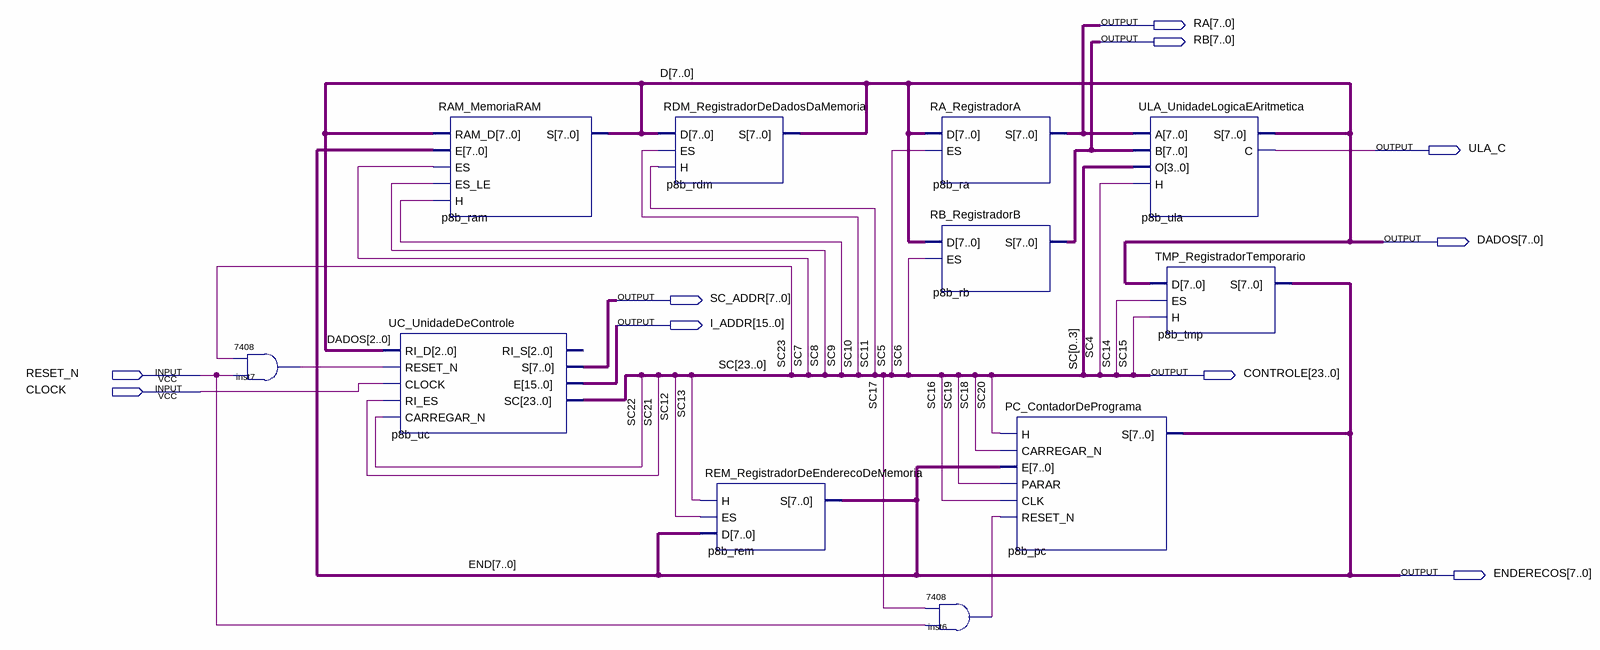
[diagram p0: schematic sheet]
// Quartus schematic Processador.bdf as structural Verilog: 11 symbols, 10 pins
module Processador (
  input  RESET_N,
  input  CLOCK,
  output [7:0] RA,
  output [7:0] RB,
  output ULA_C,
  output [7:0] DADOS,
  output [7:0] SC_ADDR,
  output [15:0] I_ADDR,
  output [23:0] CONTROLE,
  output [7:0] ENDERECOS
);

  wire inst6_1, inst7_1;

  \7408  inst7 (.\3 (RESET_N), .\2 (CONTROLE[23]), .\1 (inst7_1));
  UC_UnidadeDeControle p8b_uc (
    .RI_D(DADOS[2:0]), .RESET_N(inst7_1), .CLOCK(CLOCK), .RI_ES(CONTROLE[21]), .CARREGAR_N(CONTROLE[22]),
    .S(SC_ADDR), .E(I_ADDR), .SC(CONTROLE));  // open: RI_S
  RAM_MemoriaRAM p8b_ram (
    .RAM_D(DADOS), .E(ENDERECOS), .ES(CONTROLE[7]), .ES_LE(CONTROLE[8]), .H(CONTROLE[9]), .S(DADOS));
  RDM_RegistradorDeDadosDaMemoria p8b_rdm (.D(DADOS), .ES(CONTROLE[10]), .H(CONTROLE[11]), .S(DADOS));
  REM_RegistradorDeEnderecoDeMemoria p8b_rem (.H(CONTROLE[13]), .ES(CONTROLE[12]), .D(ENDERECOS), .S(ENDERECOS));
  RA_RegistradorA p8b_ra (.D(DADOS), .ES(CONTROLE[5]), .S(RA));
  RB_RegistradorB p8b_rb (.D(DADOS), .ES(CONTROLE[6]), .S(RB));
  \7408  inst6 (.\3 (RESET_N), .\2 (CONTROLE[17]), .\1 (inst6_1));
  PC_ContadorDePrograma p8b_pc (
    .H(CONTROLE[20]), .CARREGAR_N(CONTROLE[18]), .E(ENDERECOS), .PARAR(CONTROLE[19]), .CLK(CONTROLE[16]),
    .RESET_N(inst6_1), .S(ENDERECOS));
  ULA_UnidadeLogicaEAritmetica p8b_ula (
    .A(RA), .B(RB), .O({CONTROLE[0], CONTROLE[1], CONTROLE[2], CONTROLE[3]}), .H(CONTROLE[4]), .S(DADOS),
    .C(ULA_C));
  TMP_RegistradorTemporario p8b_tmp (.D(DADOS), .ES(CONTROLE[14]), .H(CONTROLE[15]), .S(ENDERECOS));

  // Other names for the same wires on the sheet: D[7:0] = DADOS; END[7:0] = ENDERECOS; SC[23:0] = CONTROLE;
  //   SC4 = CONTROLE[4]; SC5 = CONTROLE[5]; SC6 = CONTROLE[6]; SC7 = CONTROLE[7]; SC8 = CONTROLE[8];
  //   SC9 = CONTROLE[9]; SC10 = CONTROLE[10]; SC11 = CONTROLE[11]; SC12 = CONTROLE[12]; SC13 = CONTROLE[13];
  //   SC14 = CONTROLE[14]; SC15 = CONTROLE[15]; SC16 = CONTROLE[16]; SC17 = CONTROLE[17]; SC18 = CONTROLE[18];
  //   SC19 = CONTROLE[19]; SC20 = CONTROLE[20]; SC21 = CONTROLE[21]; SC22 = CONTROLE[22]; SC23 = CONTROLE[23]
endmodule
